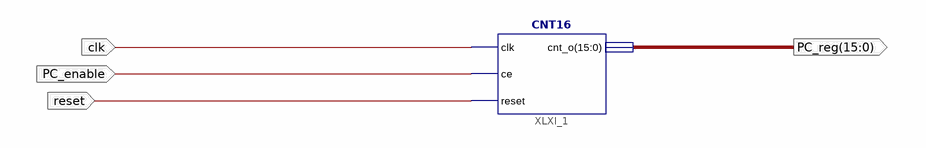
[diagram p0: schematic sheet 1]
// Xilinx ISE schematic PC_Env.sch (spartan6) as structural Verilog: 1 symbols, 4 ports
module PC_Env (
  input  clk,
  input  reset,
  input  PC_enable,
  output [15:0] PC_reg
);

  CNT16 XLXI_1 (.clk(clk), .ce(PC_enable), .reset(reset), .cnt_o(PC_reg));
endmodule
